# Altium project Vref.PrjPcb
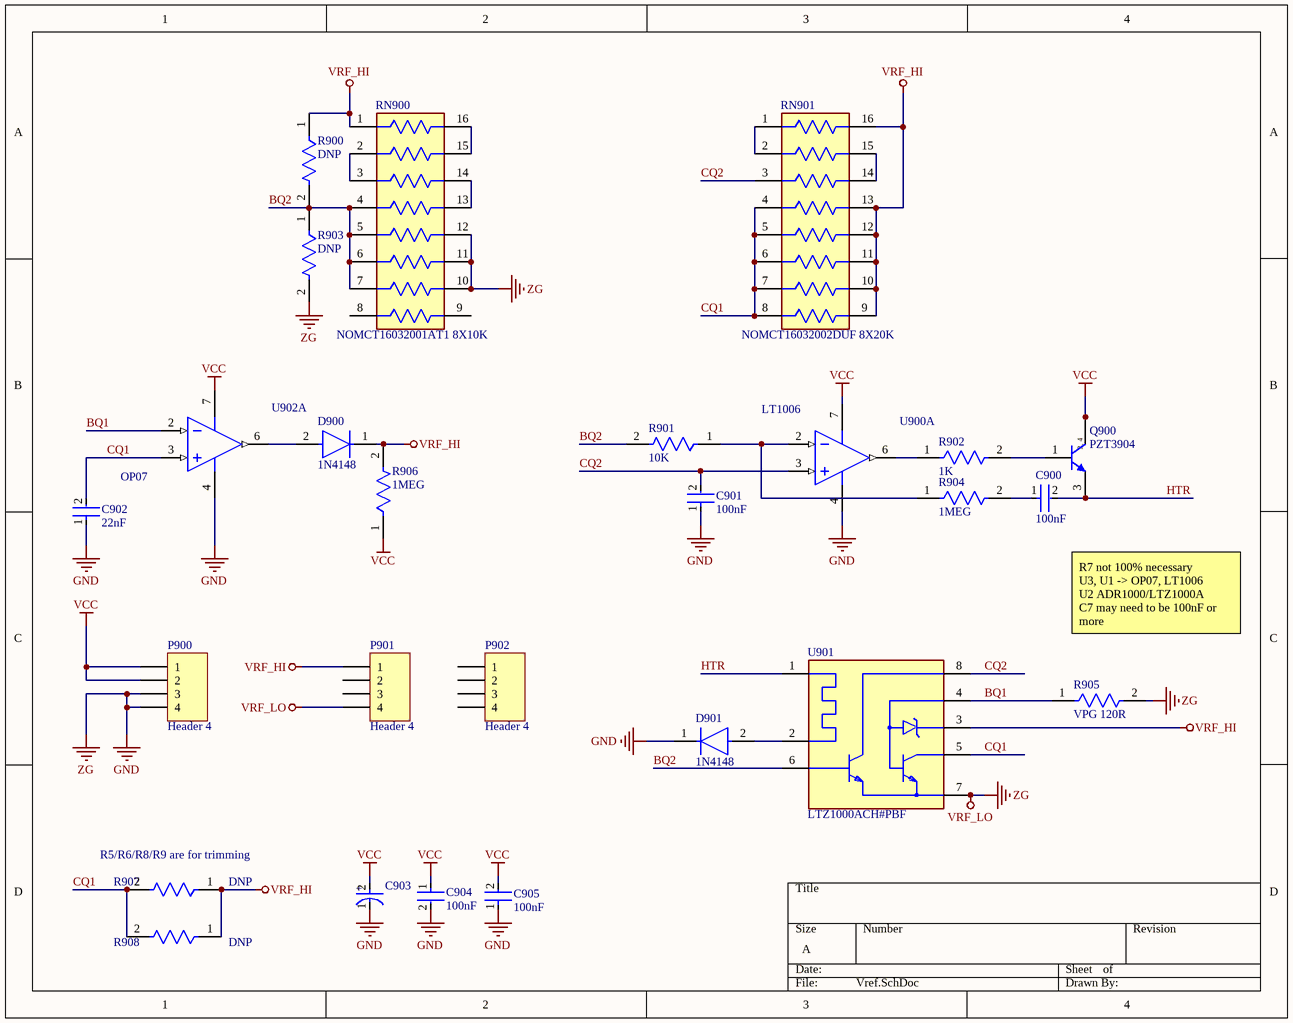
[diagram p0: Vref.SchDoc]
1 sheet, 26 parts. Net scope: global (net labels, ports and power ports of the same name join across sheets).
Board file: Vref.PcbDoc

## Sheet Vref.SchDoc
size A

### Parts
C900  100nF  [FP-CGA3E-0_3-0_1-IPC_B]
C901  100nF  [FP-CGA3E-0_3-0_1-IPC_B]
C902  22nF  [FP-CGA3E-0_3-0_1-IPC_B]
C903  T491D226K025AT  [FP-T491D226K025AT-MFG]  (value not drawn)
C904  100nF  [FP-CGA3E-0_3-0_1-IPC_B]
C905  100nF  [FP-CGA3E-0_3-0_1-IPC_B]
D900  1N4148  [FP-017AG-MFG]
D901  1N4148  [FP-017AG-MFG]
P900  Header 4  [HDR1X4]
P901  Header 4  [HDR1X4]
P902  Header 4  [HDR1X4]
Q900  PZT3904  [FAIR-SOT223-4_V]
R900  DNP  [FP-ERA3A-IPC_C]
R901  10K  [FP-ERA3A-IPC_C]
R902  1K  [FP-ERA3A-IPC_C]
R903  DNP  [FP-ERA3A-IPC_C]
R904  1MEG  [FP-CRCW0603-e3-IPC_A]
R905  VPG 120R  [FP-S102K-MFG]
R906  1MEG  [FP-CRCW0603-e3-IPC_A]
R907  DNP  [FP-ERA3A-IPC_C]
R908  DNP  [FP-ERA3A-IPC_C]
RN900  NOMCT16032001AT1 8X10K  [FP-TDP16-MFG]
RN901  NOMCT16032002DUF 8X20K  [FP-TDP16-MFG]
U900  LT1006  [D0008A_M]  (part A of 2)
U901  LTZ1000ACH#PBF  [FP-H-8-05-08-1320-MFG]
U902  OP07  [D0008A_M]  (part A of 2)

### Nets
GND: C901.1 C902.1 C903.1(C) C904.2 C905.1 D901.1(C) P900.3 P900.4 P901.4 R903.2 R905.2 RN900.10 RN900.11 RN900.12 U900.4(V-) U901.7(E) U902.4(V-)  [also labelled VRF_LO, ZG]
VCC: C903.2(A) C904.1 C905.2 P900.1 P900.2 Q900.2(C) Q900.4(C) R906.1 U900.7(V+) U902.7(V+)
VRF_HI: D900.1(C) P901.1 R900.1 R906.2 R907.1 R908.1 RN900.1 RN901.9 RN901.10 RN901.11 RN901.12 RN901.13 RN901.16 U901.3(ZENER+)
BQ1: R905.1 U901.4(SUBSTRATE/ZENER-) U902.2(IN-)
BQ2: R900.2 R901.2 R903.1 RN900.4 RN900.5 RN900.6 RN900.7 U901.6(B)
CQ1: C902.2 R907.2 R908.2 RN901.4 RN901.5 RN901.6 RN901.7 RN901.8 U901.5(C) U902.3(IN+)
CQ2: C901.2 RN901.3 U900.3(IN+) U901.8(C)
HTR: C900.2 Q900.3(E) U901.1(HEATER+)
NetC900_1: C900.1 R904.2
NetD900_2: D900.2(A) U902.6(OUT)
NetD901_2: D901.2(A) U901.2(HEATER-)
NetQ900_1: Q900.1(B) R902.2
NetR901_1: R901.1 R904.1 U900.2(IN-)
NetR902_1: R902.1 U900.6(OUT)
NetRN900_2: RN900.2 RN900.3
NetRN900_13: RN900.13 RN900.14
NetRN900_15: RN900.15 RN900.16
NetRN901_1: RN901.1 RN901.2
NetRN901_14: RN901.14 RN901.15

Not connected (* = marked no-connect by the designer): P901 2 3; P902 1 2 3 4; RN900 8 9

### Notes on the sheet
- R7 not 100% necessary
  U3, U1 -> OP07, LT1006
  U2 ADR1000/LTZ1000A
  C7 may need to be 100nF or more
- (near R907) R5/R6/R8/R9 are for trimming
- (in symbol CMP-2000-06916-1) 2, 4
- (in symbol CMP-03017-000021-1) +

### Library data of the parts
C900-C902 C904 C905 = CMP-2000-07546-2: Cap Ceramic 100nF 50V X7R 10% Pad SMD 0603 +125°C Automotive T/R; Weight: 7.1E-05oz; Composition: Ceramic; Max Operating Temperature: 125°C; Termination: SMD/SMT; Dielectric: X7R; Length: 1.6mm; Package Quantity: 1; REACH SVHC: No SVHC; Lead Free: Lead Free; Case Code (Metric): 1608; Min Operating Temperature: -55°C; Packaging: Tape and Reel; Tolerance: 10%; Voltage Rating: 50V; Case Code (Imperial): 0603; Capacitance: 100nF; Case/Package: 0603; Voltage Rating (DC): 50V; Depth: 0.8mm; Radiation Hardening: No; Ratings: AEC-Q200; Mount: Surface Mount; Voltage: 50V; Thickness: 0.035inch; Width: 0.8mm; Height: 0.8mm
C903 = CMP-03017-000021-1: CAP TANT 22UF 10% 25V 2917; Ripple Current: 433mA; Leakage Current: 5.5uA; Polarity: Polar; Dielectric Material: Tantalum; ESR (Equivalent Series Resistance): 800mR; Life (Hours): 2000Hour; Dissipation Factor: 6%; Voltage Rating: 25V; Capacitance: 22uF; Min Operating Temperature: -55°C; Length: 7.3mm; Case Code (Metric): 7343; Radiation Hardening: No; Tolerance: 10%; Case Code (Imperial): 2917; Lead Free: Lead Free; Number of Pins: 2; Mount: Surface Mount; Case/Package: 2917; Voltage Rating (DC): 25V; Termination: SMD/SMT; Voltage: 25V; Height: 2.8mm; Features: General Purpose; Depth: 4.3mm; REACH SVHC: No SVHC; Package Quantity: 1; Packaging: Tape and Reel; Height - Seated (Max): 0.122inch; Width: 4.3mm; Max Operating Temperature: 125°C
D900 D901 = CMP-07163-000046-1: DIODE GEN PURP 100V 200MA DO35; Forward Voltage: 1V; Max Power Dissipation: 500mW; Max Reverse Current: 5uA; Forward Current: 300mA; Current: 4A; Reverse Recovery Time: 4ns; Element Configuration: Single; Outside Diameter: 1.85mm; Capacitance: 4pF; Polarity: Standard; Max Forward Surge Current (Ifsm): 1A; Reverse Voltage: 100V; Output Current: 200mA; Average Rectified Current: 200mA; Diameter: 1.91mm; Max Repetitive Reverse Voltage (Vrrm): 100V; Current Rating: 200mA; Case/Package: DO-35; Lead Free: Lead Free; Number of Pins: 2; Recovery Time: 4ns; Packaging: Bulk; Contact Plating: Tin; Voltage: 100V; Mount: Through Hole; Max Surge Current: 4A; Package Quantity: 2000; Width: 1.91mm; Max Reverse Voltage (DC): 100V; Length: 4.56mm; Radiation Hardening: No; Power Dissipation: 500mW; Voltage Rating (DC): 100V; Peak Non-Repetitive Surge Current: 4A; REACH SVHC: No SVHC; Height: 4.56mm; Max Operating Temperature: 175°C; Series: -; Weight: 0.01lb; Min Operating Temperature: -65°C
P900-P902 = Header 4: Header, 4-Pin; LatestRevisionDate: 17-Jul-2002; LatestRevisionNote: Re-released for DXP Platform.; Publisher: Altium Limited
Q900 = CMP-2000-06916-1: NPN General-Purpose Amplifier, 40 V, 200 mA, -55 to 150 degC, 4-Pin SOT223, RoHS, Tape and Reel; Manufacturer: FairchildSemiconductor; Maximum Collector Emitter Saturation Voltage: 0.2@1mA@10mA; Package Version: Rev. 3, 07/2016; Rad Hard: No; Minimum DC Current Gain: 40@0.1mA@1V; Maximum DC Collector Current: 0.2A; Maximum Collector Base Voltage: 60V; Maximum Operating Frequency: 300(Min)MHz; Maximum Power Dissipation: 1000mW; Maximum Collector Emitter Voltage: 40V; Manufacturer URL: https://www.fairchildsemi.com/; Package URL: https://www.fairchildsemi.com.cn/package-drawings/MA/MA04A.pdf; Mounting Technology: SurfaceMount; Mounting: SurfaceMount; Datasheet URL: https://www.fairchildsemi.com/datasheets/MM/MMBT3904.pdf; Operating Temperature: -55to150°C; Package Description: 4-Pin Small Outline Transistor, Body 6.45 x 3.5 mm, Pitch 2.3 mm; Datasheet Version: Rev. 1.1.0, 10/2014; Packaging: Tape&Reel; Package Reference: SOT223-4; Package: 4SOT-223; Category: GPBJT; Type: NPN; Pin Count: 4
R900-R903 R907 R908 = CMP-2000-00873-2: RES SMD 1K OHM 0.1% 1/10W 0603; Temperature Coefficient: 25ppm/°C; Voltage Rating: 75V; Max Power Dissipation: 100mW; Resistance: 1kR; Technology: METAL FILM; Number of Pins: 2; Packaging: Tape and Reel; Case Code (Imperial): 0603; Case Code (Metric): 1608; Min Operating Temperature: -55°C; REACH SVHC: No SVHC; Length: 1.6mm; Termination: SMD/SMT; Depth: 0.8mm; Resistance Tolerance: 0.1%; Number of Terminations: 2; Width: 0.8mm; Military Standard: Not; Tolerance: 0.1%; Package Quantity: 5000; Contact Plating: Tin; Height: 0.45mm; Construction: Rectangular; Case/Package: 0603; Max Operating Temperature: 155°C; Resistor Type: Thin Film; Series: ERA-3A; Size Code: 0603; RoHS Compliant: Yes; Mount: Surface Mount; Radiation Hardening: No; Power Rating: 100mW
R904 R906 = CMP-2000-03013-2: RES Thick Film, 1MΩ, 1%, 0.1W, 100ppm/°C, 0603; Max Power Dissipation: 100mW; Resistance: 1MR; Voltage Rating (DC): 75V; Depth: 0.85mm; Max Operating Temperature: 155°C; Length: 1.55mm; Power Rating: 100mW; Military Standard: Not; Features: Automotive AEC-Q200; Min Operating Temperature: -55°C; Number of Pins: 2; Mount: Surface Mount; Package Quantity: 10; Packaging: Tape and Reel; Height: 0.45mm; Radiation Hardening: No; Case Code (Metric): 1608; Temperature Coefficient: 100ppm/°C; Width: 0.85mm; Composition: Thick Film; Termination: SMD/SMT; Tolerance: 1%; Number of Terminations: 2; Lead Free: Lead Free; Contact Plating: Tin; Case/Package: 0603; Weight: 7.1E-05oz; Voltage Rating: 75V; Case Code (Imperial): 0603
R905 = CMP-10850-000015-1: RES 20K OHM 0.6W 0.01% RADIAL; Resistance: 20kR; Voltage Rating: 300V; Temperature Coefficient: 1ppm/°C; Power Rating: 600mW; RoHS Compliant: Yes; Resistor Type: Metal Foil; Tolerance: 0.01%; Mount: Through Hole; Case/Package: Radial; Resistance Tolerance: 0.01%
RN900 RN901 = CMP-02406-000013-1: Res Thin Film NET 100K Ohm 0.5% 4/5W ±25ppm/°C ISOL Molded 16-Pin DIP Pin Thru-Hole Tube; Number of Resistors: 8; Number of Terminals/Pins: 16; Resistance: 100kR; Technology: THIN FILM; Temperature Coefficient: 25ppm/°C; Number of Pins: 16; Radiation Hardening: No; Packaging: Bulk; Min Operating Temperature: -55°C; Max Operating Temperature: 125°C; Case/Package: DIP; RoHS Compliant: No; Mount: Through Hole
U900 U902 = CMP-0271-00131-3: 11 MHz, Single Supply, Low Noise, Precision, Rail-to-Rail Output, JFET Amplifier, 4.5 to 36 V, -40 to 125 degC, 8-pin SOIC (D8), Green (RoHS & no Sb/Br); Manufacturer: Texas Instruments; PartNumber: OPA140AID; Vio (25C)(Max)(mV): 0.12; Number of Channels: 1; Packing: TUBE; Rating: Catalog; Offset Drift(Typ)(uV/C): 0.35; Sub Family: High Supply Voltage Amplifier (>=30V), Low Input Bias Current Amp (<=10pA), Low Noise Amp (<=10nV/rtHz), Low Offset Voltage Amplifier (<=500uV), Precision Amplifier; Total Supply Voltage(Min)(+5V is 5, +/-5V is 10): 4.5; Iq per channel(Max)(mA): 2; Total Supply Voltage(Max)(+5V is 5, +/-5V is 10): 36; IIB(Max)(pA): 10; GBW(Typ)(MHz): 11; CMRR(Min)(dB): 126; Slew Rate(Typ)(V/us): 20; PackageDescription: 8-Pin Plastic Small Outline, Body 4.9 x 3.9 mm, Pitch 1.27 mm; PackageReference: D0008A; ComponentLink3Description: Package Specification; ComponentLink3URL: http://www.ti.com/litv/pdf/msoi002j; DatasheetVersion: SBOS498A; Mounting Technology: Surface Mount; ComponentLink2Description: Datasheet; ComponentLink2URL: http://www.ti.com/lit/ds/symlink/opa140.pdf; ComponentLink1Description: Manufacturer URL; ComponentLink1URL: http://www.ti.com/; PackageVersion: 4040047-3/M, 06/2011; Code_JEDEC: MS-012; Eco-Plan: Green (RoHS & no Sb/Br)
U901 = CMP-09137-000002-1: IC VREF SHUNT 7.2V TO5; Manufacturer: Analog Devices; Number Of Outputs: 1; Output Type: Fixed; Standoff Height: 0.254mm; Reference Type: Buried Zener; Max Junction Temp: +150°C; Octopart: https://octopart.com/ltz1000ach%23pbf-analog+devices-88320833; Temperature Range High: +125°C; Height: 5.969mm; Temperature Range Low: -55°C; ComponentLink2URL: https://www.analog.com/media/en/technical-documentation/data-sheets/LTZ1000.pdf; Digikey Description: IC VREF SHUNT 7.2V TO5; ComponentLink2Description: Datasheet; Ambient Temperature Range High: +125°C; Ambient Temperature Range Low: -55°C; Automotive: No; RoHS: TRUE; Device Class L1: Integrated Circuits (ICs); Package: H-8-05-08-1320; Device Class L2: Power Management ICs; Device Class L3: Voltage References; Manufacturer Part Number: LTZ1000ACH#PBF; Category: IC; Lead Free: Yes; Temperature: -55°C to +125°C